# Altium schematic sheet Schematic_worm_robot_pneumatic_board_v1.SchDoc
size A
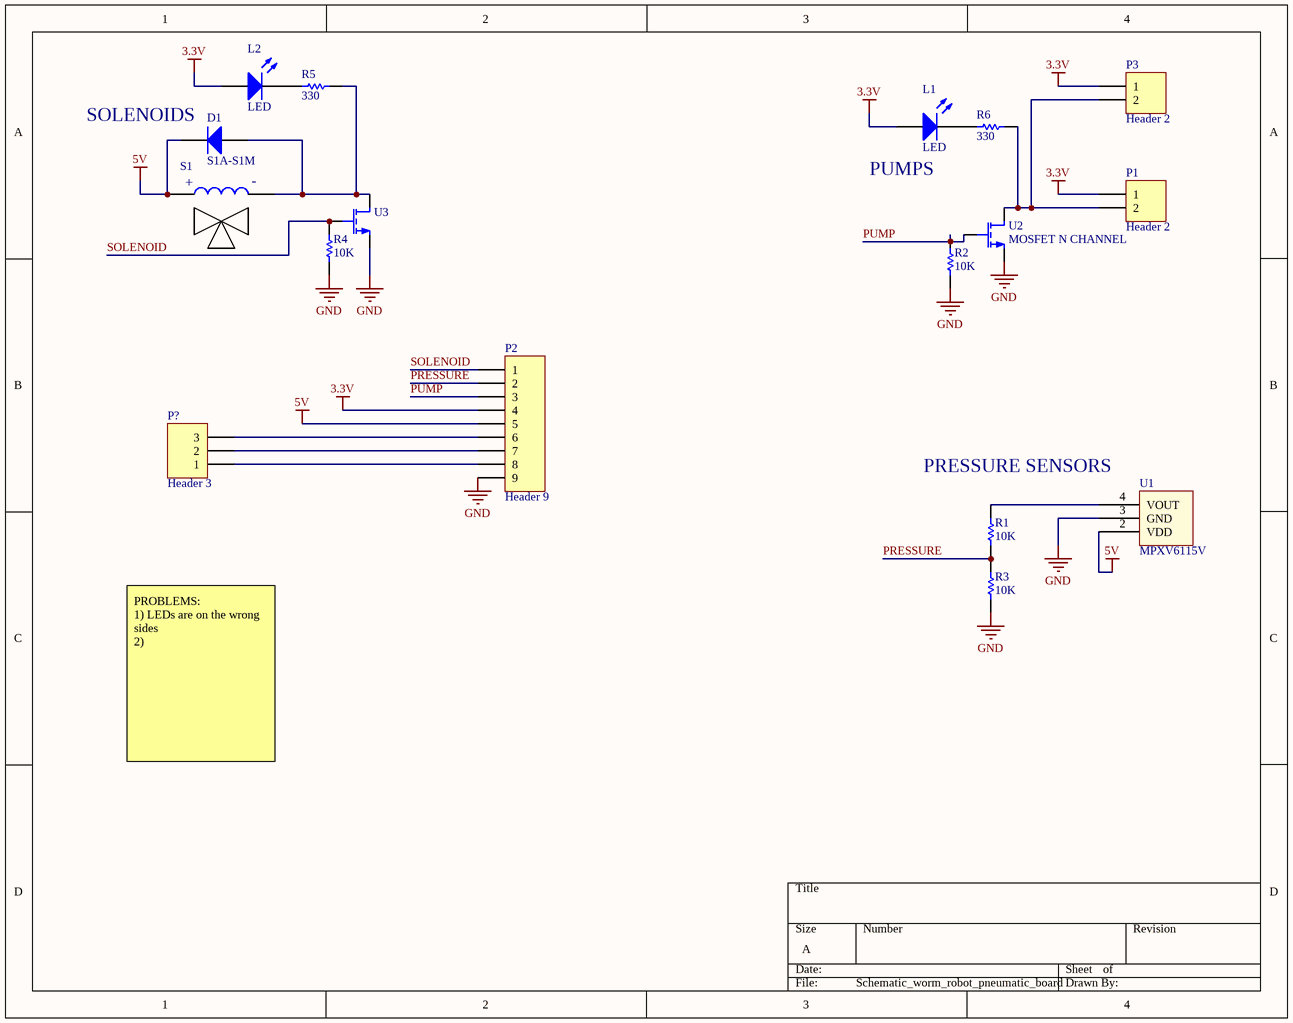
[diagram p0: Schematic_worm_robot_pneumatic_board_v1.SchDoc]

## Parts
D1  S1A-S1M  [JEDEC DO-214]
L1  LED  [RES_1206_SMD]
L2  LED  [RES_1206_SMD]
P1  Header 2  [HDR1X2]
P2  Header 9  [HDR1X9]
P3  Header 2  [HDR1X2]
P?  Header 3  [HDR1X3]
R1  10K  [0603W]
R2  10K  [0603W]
R3  10K  [0603W]
R4  10K  [0603W]
R5  330  [0603W]
R6  330  [0603W]
S1  SOLENOID VALVE  [S070C-5CG-32]  (value not drawn)
U1  MPXV6115V  [MPXV6115V]
U2  MOSFET N CHANNEL  [SOT323]
U3  MOSFET N CHANNEL  [SOT323]  (value not drawn)

## Nets
3.3V: L1.1(A) L2.1(A) P1.1 P2.4 P3.1
5V: D1.1(C) P2.5 S1.1(+) U1.2(VDD)
GND: P2.9 R2.2 R3.2 R4.2 U1.3(GND) U2.2(S) U3.2(S)
PRESSURE: P2.2 R1.2 R3.1
PUMP: P2.3 R2.1 U2.1(G)
SOLENOID: P2.1 R4.1 U3.1(G)
NetD1_2: D1.2(A) R5.2 S1.2(-) U3.3(D)
NetL1_2: L1.2(K) R6.1
NetL2_2: L2.2(K) R5.1
NetP1_2: P1.2 P3.2 R6.2 U2.3(D)
NetP2_6: P2.6 P?.3
NetP2_7: P2.7 P?.2
NetP2_8: P2.8 P?.1
NetR1_1: R1.1 U1.4(VOUT)

## Notes on the sheet
- (near D1) SOLENOIDS
- (near L1) PUMPS
- (near R1) PRESSURE SENSORS
- PROBLEMS:
  1) LEDs are on the wrong sides
  2)

## Library data of the parts
D1 = S1A-S1M: General purpose diode 50V 1A SMA; Supplier 1: Digikey; Supplier Part Number 1: ES1AFSCT-ND
L1 L2 = LED: LED SMD 1206/0603; digikey part number: *; manufacturer part number: *; manufacturer: *
P1 P3 = Header 2: Header, 2-Pin; LatestRevisionDate: 17-Jul-2002; LatestRevisionNote: Re-released for DXP Platform.; Publisher: Altium Limited
P2 = Header 9: Header, 9-Pin; LatestRevisionDate: 17-Jul-2002; LatestRevisionNote: Re-released for DXP Platform.; Publisher: Altium Limited
P? = Header 3: Header, 3-Pin; LatestRevisionDate: 17-Jul-2002; LatestRevisionNote: Re-released for DXP Platform.; Publisher: Altium Limited
R1-R6 = Resistor: Supplier 1: Digikey; Supplier Part Number 1: 311-10KJRCT-ND
U1 = MPXV6115V: Vacuum pressure sensor -115kPa; Supplier 1: Digikey; Supplier Part Number 1: MPXV6115VC6U-ND
U2 U3 = MOSFET N CHANNEL: digikey part number: 1727-4793-1-ND